# Altium schematic sheet FiberOptic_Э3.SchDoc: Оптоволоконный передатчик
size 594 x 420 mm; CheckedBy: Ремизов А.; Author: Загуменнов; CompanyName: ООО "Аэроксо"; DocumentNumber: Э3; SheetNumber: 1; SheetTotal: 1; Scale: 1:1; DocumentType: Схема электрическая принципиальная
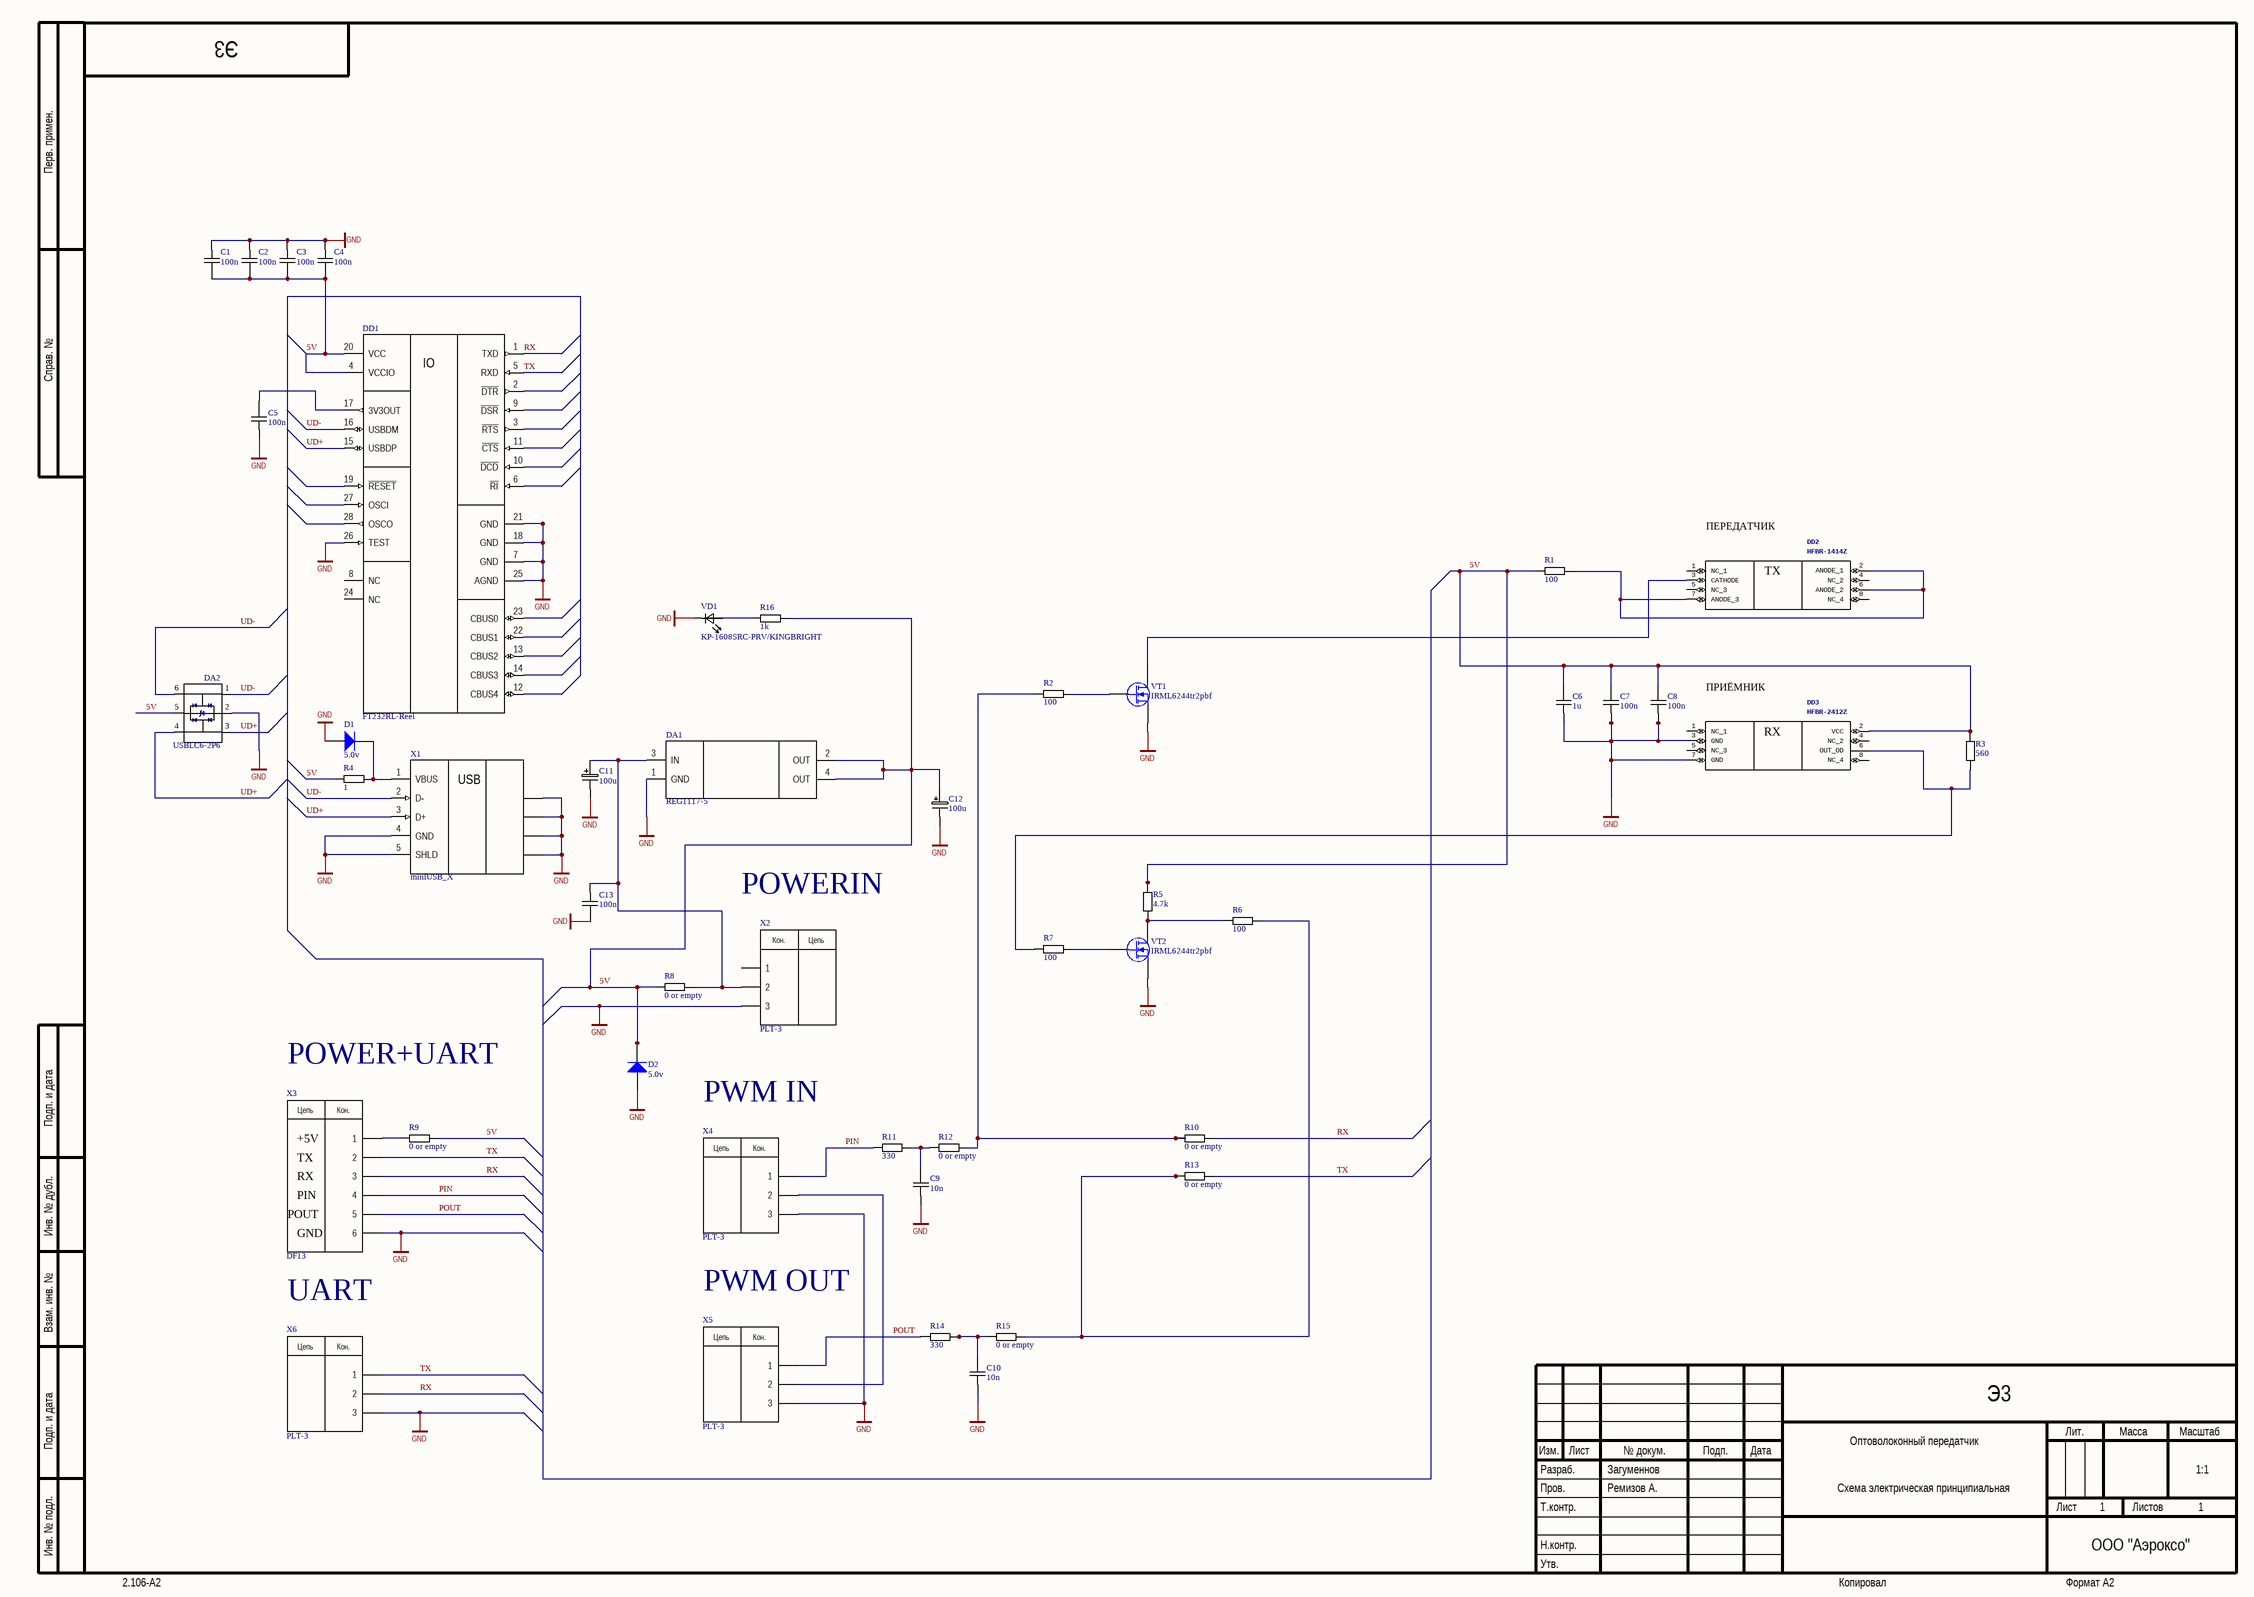
[diagram p0: FiberOptic_Э3.SchDoc]

## Parts
C1  100n  [SMT0603CAP/VISHAY]
C2  100n  [SMT0603CAP/VISHAY]
C3  100n  [SMT0603CAP/VISHAY]
C4  100n  [SMT0603CAP/VISHAY]
C5  100n  [SMT0603CAP/VISHAY]
C6  1u  [SMT0603CAP/VISHAY]
C7  100n  [SMT0603CAP/VISHAY]
C8  100n  [SMT0603CAP/VISHAY]
C9  10n  [SMT0603CAP/VISHAY]
C10  10n  [SMT0603CAP/VISHAY]
C11  100u  [VISHAY-TANTALUM-CAP-TYPE-C/VISHAY]
C12  100u  [VISHAY-TANTALUM-CAP-TYPE-C/VISHAY]
C13  100n  [SMT0603CAP/VISHAY]
D1  5.0v  [SMB]
D2  5.0v  [SMB]
DA1  REG1117-5  [ZZ311]
DA2  USBLC6-2P6  [SOT50P160X60-6N]
DD1  FT232RL-Reel  [SSOP-28_N]
DD2  HFBR-1414Z  [HFBR1414Z]
DD3  HFBR-2412Z  [HFBR2412Z]
R1  100  [SMT0603/VISHAY]
R2  100  [SMT0603/VISHAY]
R3  560  [SMT0603/VISHAY]
R4  1  [SMT0603/VISHAY]
R5  4.7k  [SMT0603/VISHAY]
R6  100  [SMT0603/VISHAY]
R7  100  [SMT0603/VISHAY]
R8  0 or empty  [SMT0603/VISHAY]
R9  0 or empty  [SMT0603/VISHAY]
R10  0 or empty  [SMT0603/VISHAY]
R11  330  [SMT0603/VISHAY]
R12  0 or empty  [SMT0603/VISHAY]
R13  0 or empty  [SMT0603/VISHAY]
R14  330  [SMT0603/VISHAY]
R15  0 or empty  [SMT0603/VISHAY]
R16  1k  [SMT0603/VISHAY]
VD1  KP-1608SRC-PRV/KINGBRIGHT  [1.6x0.8SMTLED/KINGBRIGHT]
VT1  IRML6244tr2pbf  [SOT23_N]
VT2  IRML6244tr2pbf  [SOT23_N]
X1  miniUSB_X  [miniUSB_AB]
X2  PLT-3  [PLT-3T]
X3  DF13  [HIROSE DF13-6P-1.25H]
X4  PLT-3  [PLT-3T]
X5  PLT-3  [PLT-3T]
X6  PLT-3  [PLT-3T]

## Nets
GND: C1.2 C2.2 C3.2 C4.2 C5.2 C6.2 C7.2 C8.2 C9.2 C10.2 C11.2 C12.2 C13.1 D1.1(A) D2.1(A) DA1.1(GND) DA2.2(GND) DD1.7(GND) DD1.18(GND) DD1.21(GND) DD1.25(AGND) DD1.26(TEST) DD3.3(GND) DD3.7(GND) VD1.2 VT1.3(S) VT2.3(S) X1.4(GND) X1.5(SHLD) X1.6(SHLD) X1.7(SHLD) X1.8(SHLD) X1.9(SHLD) X2.3 X3.6 X4.3 X5.3 X6.3
5V: C1.1 C2.1 C3.1 C4.1 C6.1 C7.1 C8.1 C12.1 D2.2(K) DA1.2(OUT) DA1.4(OUT) DA2.5(VBUS) DD1.4(VCCIO) DD1.20(VCC) DD3.2(VCC) R1.2 R3.2 R4.2 R5.1 R8.1 R9.2 R16.2
PIN: R11.1 X3.4 X4.1
POUT: R14.1 X3.5 X5.1
RX: DD1.1(TXD) R10.2 X3.3 X6.2
TX: DD1.5(RXD) R13.2 X3.2 X6.1
UD+: DA2.3(I/O2_1) DA2.4(I/O2_2) DD1.15(USBDP) X1.3(D+)
UD-: DA2.1(I/O1_1) DA2.6(I/O1_2) DD1.16(USBDM) X1.2(D-)
NetC5_1: C5.1 DD1.17(3V3OUT)
NetC9_1: C9.1 R11.2 R12.1
NetC10_1: C10.1 R14.2 R15.1
NetC11_1: C11.1 C13.2 DA1.3(IN) R8.2 X2.2
NetD1_2: D1.2(K) R4.1 X1.1(VBUS)
NetDD2_2: DD2.2(ANODE_1) DD2.6(ANODE_2) DD2.7(ANODE_3) R1.1
NetDD2_3: DD2.3(CATHODE) VT1.1(D)
NetDD3_6: DD3.6(OUT_OD) R3.1 R7.2
NetR2_1: R2.1 VT1.2(G)
NetR2_2: R2.2 R10.1 R12.2
NetR5_2: R5.2 R6.2 VT2.1(D)
NetR6_1: R6.1 R13.1 R15.2
NetR7_1: R7.1 VT2.2(G)
NetR9_1: R9.1 X3.1
NetR16_1: R16.1 VD1.1
NetX4_2: X4.2 X5.2

Not connected (* = marked no-connect by the designer): DD1 2(~{DTR}) 3(~{RTS}) 6(~{RI}) 8(NC) 9(~{DSR}) 10(~{DCD}) 11(~{CTS}) 12(CBUS4) 13(CBUS2) 14(CBUS3) 19(~{RESET}) 22(CBUS1) 23(CBUS0) 24(NC) 27(OSCI) 28(OSCO); DD2 1(NC_1) 4(NC_2) 5(NC_3) 8(NC_4); DD3 1(NC_1) 4(NC_2) 5(NC_3) 8(NC_4); X2 1

## Notes on the sheet
- Перв. примен.
- Справ. №
- (near DD2) ПЕРЕДАТЧИК
- ПРИЁМНИК
- POWERIN
- POWER+UART
- Подп. и дата
- PWM IN
- +5V
- TX
- RX
- POUT
- PIN
- Инв. № дубл.
- GND
- UART
- PWM OUT
- Взам. инв. №
- Разраб.
- Изм.
- Лист
- № докум.
- Подп.
- Дата
- Лит.
- Масса
- Масштаб
- Пров.
- Т.контр.
- Листов
- Инв. № подл.
- Утв.
- Н.контр.
- 2.106-A2
- Копировал
- Формат А2
- (in symbol DF13-6P) Цепь; Кон.
- (in symbol FT232RL-Reel) IO
- (in symbol HFBR-1414Z) TX
- (in symbol HFBR-2412Z) RX
- (in symbol miniUSB_X) USB
- (in symbol PLT-3) Цепь; Кон.

## Library data of the parts
C1-C10 C13 = CC0603JRNPO9BN181/YAGEO: 180p 50V 0603 cap; PackageReference: 0603
C11 C12 = 293D107X9010C2TE3/VISHAY_1: 100u 10V tantalum cap
D1 D2 = Diode: Default Diode; Published: 8-Jun-2000; LatestRevisionDate: 17-Jul-2002; LatestRevisionNote: Re-released for DXP Platform.; PackageVersion: Sep-1996; PackageReference: SMC; Publisher: Altium Limited; PackageDescription: DO-214-AB/SMC; 2 C-Bend Leads; Body 7.9 x 5.9 mm, inc. leads (LxW); Code_JEDEC: DO-214-AB
DA1 = REG1117-5: 800mA and 1A Low Dropout Positive Regulator 2.85V, 3.3V, 5V, and Adjustable; Published: 8-Jun-2000; LatestRevisionDate: 17-Jul-2002; LatestRevisionNote: Re-released for DXP Platform.; DatasheetVersion: Sep-1997; PackageVersion: revC; PackageReference: ZZ311; Publisher: Altium Limited; PackageDescription: SOT-223/SC-73; 4 Leads; Body 6.7 x 7.3 mm, inc. leads (LxW max); ComponentLink1Description: Manufacturer Link; ComponentLink1URL: http://www.ti.com/; ComponentLink2Description: Datasheet; ComponentLink2URL: http://www-s.ti.com/sc/ds/REG1117.pdf
DA2 = USBLC6-2P6: USBLC6 Series 2 Line 6 V SMT Bi Directional ESD Protection - SOT-666; MF: STMicroelectronics; Package: SOT-563 STMicroelectronics; MP: USBLC6-2P6; Price: None; Availability: Unavailable; SnapEDA_Link: https://www.snapeda.com/parts/USBLC6-2P6/STMicroelectronics/view-part/?ref=snap; Value: *
DD1 = FT232RL-Reel: USB UART Asynchronous Serial Data Transfer Chip, 28-pin SSOP, Tape and Reel; Manufacturer: FTDI; DatasheetVersion: ver 2.10, Mar-2012; PackageVersion: Mar-12; PackageReference: SSOP-28; PackageDescription: 28-Pin Small Outline Package 0.65 mm Pitch; PartNumber: FT232RL-Reel; ComponentLink1Description: Manufacturer URL; ComponentLink1URL: http://www.ftdichip.com/; ComponentLink2Description: Datasheet; ComponentLink2URL: http://www.ftdichip.com/Support/Documents/DataSheets/ICs/DS_FT232R.pdf
DD2 = HFBR-1414Z: Manufacturer_Name: Avago Technologies; GateName_1: G$1; SymbolName_1: HFBR-1414Z; LibraryName: HFBR-1414Z; DeviceSetName: HFBR-1414Z; Package: HFBR2416Z; Manufacturer_Part_Number: HFBR-1414Z; RS_Part_Number: 4965692; RS_Price-Stock: http://uk.rs-online.com/web/p/products/4965692; Arrow_Part_Number: HFBR-1414Z; Arrow_Price-Stock: http://uk.rs-online.com/web/p/products/4965692; Height: mm
DD3 = HFBR-2412Z: Manufacturer_Name: Avago Technologies; GateName_1: G$1; SymbolName_1: HFBR-1414Z; LibraryName: HFBR-1414Z; DeviceSetName: HFBR-1414Z; Package: HFBR2416Z; Manufacturer_Part_Number: HFBR-1414Z; RS_Part_Number: 4965692; RS_Price-Stock: http://uk.rs-online.com/web/p/products/4965692; Arrow_Part_Number: HFBR-1414Z; Arrow_Price-Stock: http://uk.rs-online.com/web/p/products/4965692; Height: mm
R1-R3 R5-R7 R10 R13-R16 = CRCW060310K0FKEA/MURATA: 10k
  R16: PackageReference: 0603
R4 = CRCW060310K0FKEA/MURATA: 0; PackageReference: 0603
R8 R9 R12 = CRCW060310K0FKEA/MURATA
R11 = CRCW060310K0FKEA/MURATA: 0 or empty
VD1 = KP-1608SRC-PRV/KINGBRIGHT: Red 0603 LED; PackageReference: 0603
VT1 VT2 = IRML6244tr2pbf: N-Channel MOSFET; pin to pad: 1>3 2>1 3>2; Published: 8-Jun-2000; LatestRevisionDate: 17-Jul-2002; LatestRevisionNote: Re-released for DXP Platform.; PackageVersion: 1995/1996; PackageReference: E3; Publisher: Altium Limited; PackageDescription: TO, Flat Index; 3 In-Line, Axial Leads; Body Dia. 4.6mm; Lead Dia. 0.5 mm (max)
X1 = miniUSB_X: USB 2.0, Right Angle, SMT, A Type, Receptacle, 5 Position, Black; ContactMaterial: Phosphor Bronze; ContactPlating: Gold (30) over Nickel; PCB_Layout: Complies with manufacturer's recommendation.; DrillSize: Corresponds to nominal value.; PanelGround: Without; Published: 15-Jul-2004; DatasheetDocument: 15-Nov-2002; PackageDocument: 15-Nov-2002; PackageReference: 440478; Publisher: Altium Limited; HousingMaterial: Thermoplastic; ComponentLink1Description: Manufacturer Link; ComponentLink1URL: http://www.tycoelectronics.com/; ComponentLink2Description: Packaging Specification; ComponentLink2URL: http://ecommas.tycoelectronics.com/commerce/DocumentDelivery/DDEController?Action=showdoc&DocId=Customer+Drawing%7F440478%7FB%7Fpdf%7FEnglish%7FC_440478_B.pdf
X3 = DF13-6P